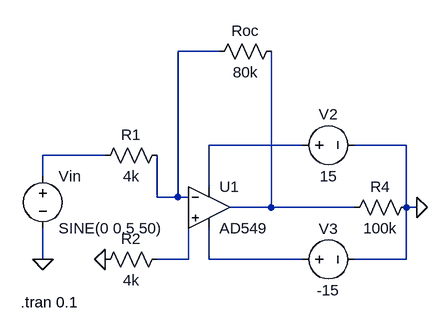
[diagram p0: schematic Draft1.asc]
Draft1.asc, the LTspice schematic file:
Version 4
SHEET 1 880 680
WIRE 240 -80 176 -80
WIRE 368 64 224 64
WIRE 528 64 448 64
WIRE 64 80 -32 80
WIRE -32 112 -32 80
WIRE 224 128 224 64
WIRE 144 144 144 80
WIRE 176 144 176 -80
WIRE 176 144 144 144
WIRE 192 144 176 144
WIRE 320 160 320 -80
WIRE 320 160 256 160
WIRE 448 160 320 160
WIRE 528 160 528 64
WIRE 544 160 528 160
WIRE -32 240 -32 192
WIRE 192 240 192 176
WIRE 192 240 144 240
WIRE 224 240 224 192
WIRE 368 240 224 240
WIRE 528 240 528 160
WIRE 528 240 448 240
FLAG -32 240 0
FLAG 544 160 0
FLAG 64 240 0
SYMBOL OpAmps\\AD549 224 96 R0
SYMATTR InstName U1
SYMBOL voltage 352 64 R270
WINDOW 0 32 56 VTop 2
WINDOW 3 -32 56 VBottom 2
SYMATTR InstName V2
SYMATTR Value 15
SYMBOL voltage 352 240 R270
WINDOW 0 32 56 VTop 2
WINDOW 3 -32 56 VBottom 2
SYMATTR InstName V3
SYMATTR Value -15
SYMBOL voltage -32 96 R0
WINDOW 123 0 0 Left 0
WINDOW 39 0 0 Left 0
SYMATTR InstName Vin
SYMATTR Value SINE(0 0.5 50)
SYMBOL res 160 64 R90
WINDOW 0 0 56 VBottom 2
WINDOW 3 32 56 VTop 2
SYMATTR InstName R1
SYMATTR Value 4k
SYMBOL res 160 224 R90
WINDOW 0 0 56 VBottom 2
WINDOW 3 32 56 VTop 2
SYMATTR InstName R2
SYMATTR Value 4k
SYMBOL res 336 -96 R90
WINDOW 0 0 56 VBottom 2
WINDOW 3 32 56 VTop 2
SYMATTR InstName Roc
SYMATTR Value 80k
SYMBOL res 544 144 R90
WINDOW 0 0 56 VBottom 2
WINDOW 3 32 56 VTop 2
SYMATTR InstName R4
SYMATTR Value 100k
TEXT -66 306 Left 2 !.tran 0.1

The netlist it stands for:
* Draft1.asc
XU1 N005 N001 N002 N006 N004 AD549  ; pins In+ In- V+ V- OUT
V2 N002 0 15
V3 N006 0 -15
Vin N003 0 SINE(0 0.5 50)
R1 N001 N003 4k
R2 N005 0 4k
Roc N004 N001 80k
R4 0 N004 100k
.tran 0.1
.backanno
.end